# EAGLE schematic main (EAGLE 9.2.2)
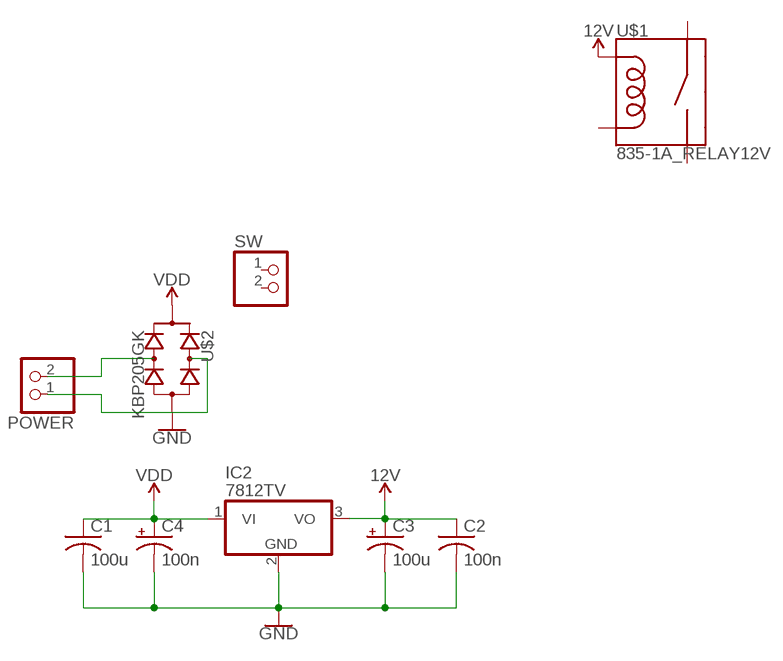
[diagram p0: schematic, sheet 1]

## Parts
C1  100u  C-US025-025X050  [C025-025X050]
C2  100n  C-US025-025X050  [C025-025X050]
C3  100u  CPOL-USE2-5  [E2-5]
C4  100n  CPOL-USE2-5  [E2-5]
IC2  7812TV  [TO220V]
POWER  PINHD-1X2  [1X02]
SW  PINHD-1X2  [1X02]
U$1  835-1A_RELAY12V  [835-1A_RELAY_12V]
U$2  KBP205GK  [KBP205G]

## Nets
12V: C2.1 C3.+ IC2.3(VO) U$1.P$1(COIL1)
GND: C1.2 C2.2 C3.- C4.- IC2.2(GND) U$2.-
N$1: POWER.2 U$2.AC@2(AC)
N$2: POWER.1 U$2.AC@1(AC)
VDD: C1.1 C4.+ IC2.1(VI) U$2.+
Unconnected: SW.1 SW.2 U$1.P$2(COIL2) U$1.P$3(MAIN) U$1.P$4(NO)

## Library data of the parts
C1 C2 = rcl:C-US: CAPACITOR, American symbol; SPICEPREFIX: C
C3 C4 = rcl:CPOL-US: POLARIZED CAPACITOR, American symbol; SPICEPREFIX: C
IC2 = linear:78*: Positive VOLTAGE REGULATOR Source: http://cache.national.com/ds/LM/LM78L05.pdf http://www.fairchildsemi.com/ds/LM/LM7805.pdf
POWER SW = pinhead:PINHD-1X2: PIN HEADER
U$1 = 7_segment_lib:835-1A_RELAY12V
U$2 = 7_segment_lib:KBP205G